# EAGLE design audio-mixer (EAGLE 6.6.0)
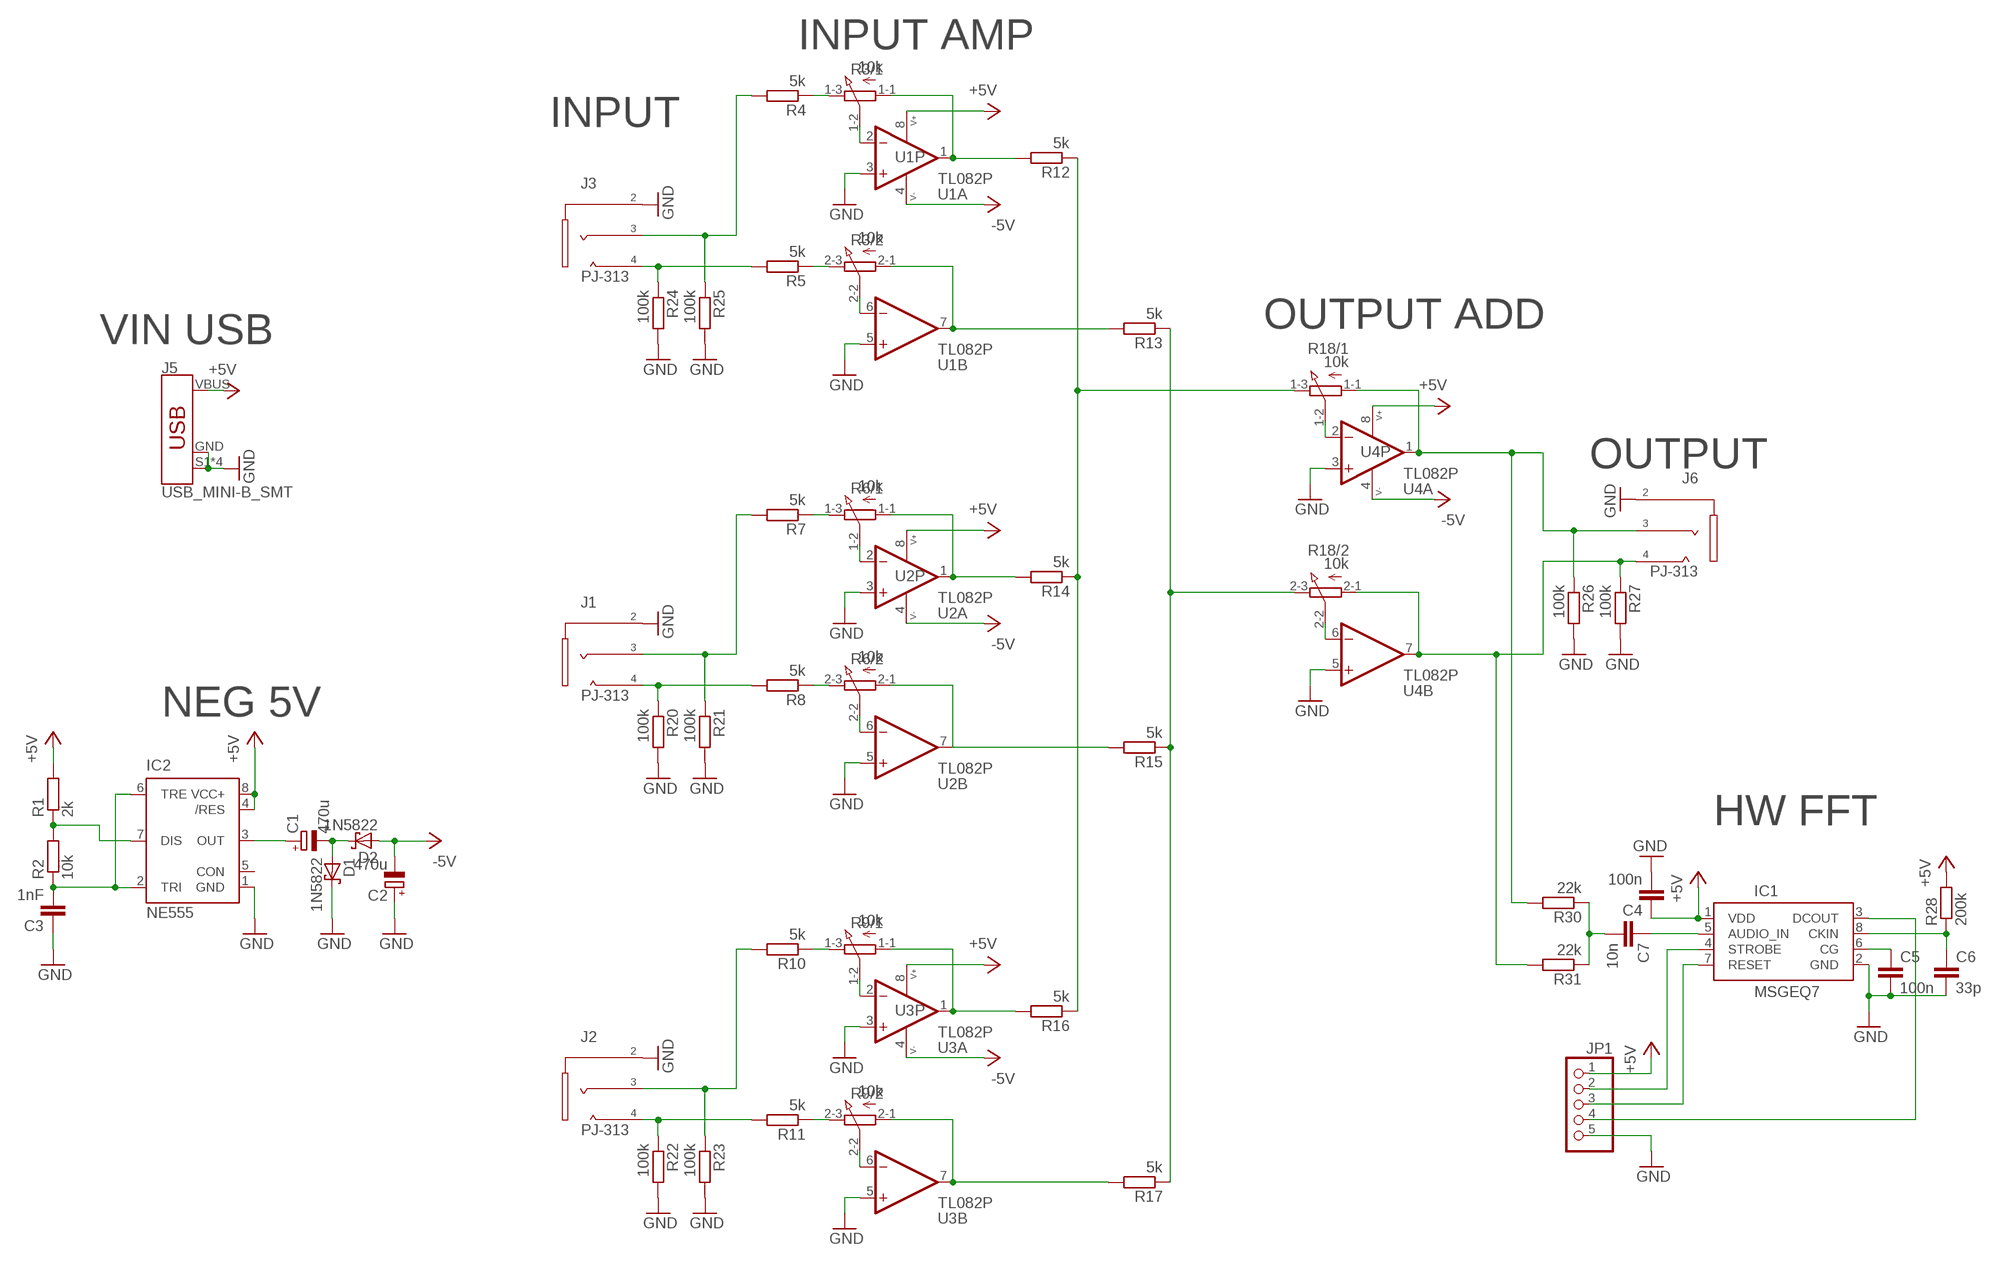
[diagram p0: schematic, sheet 1]

## Parts
C1  470u  CPOL-EUE5-8.5  [E5-8,5]
C2  470u  CPOL-EUE5-8.5  [E5-8,5]
C3  1nF  C-EU025-025X050  [C025-025X050]
C4  100n  C-EU025-025X050  [C025-025X050]
C5  100n  C-EU025-025X050  [C025-025X050]
C6  33p  C-EU025-025X050  [C025-025X050]
C7  10n  C-EU025-025X050  [C025-025X050]
D1  1N5822  1N5817-B  [DO41-7.6]
D2  1N5822  1N5817-B  [DO41-7.6]
IC1  MSGEQ7DIP  [DIL08]
IC2  NE555  [DIL-08]
J1  PJ-313  [PJ-313]
J2  PJ-313  [PJ-313]
J3  PJ-313  [PJ-313]
J5  USB_MINI-B_SMT  [USB-MINIB]
J6  PJ-313  [PJ-313]
JP1  PINHD-1X05_2.54-S  [1X05-S]
R1  2k  R-EU_0207/10  [0207/10]
R2  10k  R-EU_0207/10  [0207/10]
R3  10k  3RP/1610G  [3RP/1610G]
R4  5k  R-EU_0207/10  [0207/10]
R5  5k  R-EU_0207/10  [0207/10]
R6  10k  3RP/1610G  [3RP/1610G]
R7  5k  R-EU_0207/10  [0207/10]
R8  5k  R-EU_0207/10  [0207/10]
R9  10k  3RP/1610G  [3RP/1610G]
R10  5k  R-EU_0207/10  [0207/10]
R11  5k  R-EU_0207/10  [0207/10]
R12  5k  R-EU_0207/10  [0207/10]
R13  5k  R-EU_0207/10  [0207/10]
R14  5k  R-EU_0207/10  [0207/10]
R15  5k  R-EU_0207/10  [0207/10]
R16  5k  R-EU_0207/10  [0207/10]
R17  5k  R-EU_0207/10  [0207/10]
R18  10k  3RP/1610G  [3RP/1610G]
R20  100k  R-EU_0207/10  [0207/10]
R21  100k  R-EU_0207/10  [0207/10]
R22  100k  R-EU_0207/10  [0207/10]
R23  100k  R-EU_0207/10  [0207/10]
R24  100k  R-EU_0207/10  [0207/10]
R25  100k  R-EU_0207/10  [0207/10]
R26  100k  R-EU_0207/10  [0207/10]
R27  100k  R-EU_0207/10  [0207/10]
R28  200k  R-EU_0207/10  [0207/10]
R30  22k  R-EU_0207/10  [0207/10]
R31  22k  R-EU_0207/10  [0207/10]
U1  TL082P  [DIL08]
U2  TL082P  [DIL08]
U3  TL082P  [DIL08]
U4  TL082P  [DIL08]

## Nets
+5V [power]: C4.1 IC1.1(VDD) IC2.4(/RES) IC2.8(VCC+) J5.VBUS JP1.1 R1.2 R28.2 U1.8(P:V+) U2.8(P:V+) U3.8(P:V+) U4.8(P:V+)
-5V [power]: C2.- D2.A U1.4(P:V-) U2.4(P:V-) U3.4(P:V-) U4.4(P:V-)
GND [power]: C2.+ C3.1 C4.2 C5.2 C6.2 D1.C IC1.2(GND) IC2.1(GND) J1.2_1 J1.2_2 J2.2_1 J2.2_2 J3.2_1 J3.2_2 J5.GND J5.S1(SHIELD) J5.S2(SHIELD) J5.S3(SHIELD) J5.S4(SHIELD) J6.2_1 J6.2_2 JP1.5 R20.2 R21.2 R22.2 R23.2 R24.2 R25.2 R26.2 R27.2 U1.3(A:+IN) U1.5(B:+IN) U2.3(A:+IN) U2.5(B:+IN) U3.3(A:+IN) U3.5(B:+IN) U4.3(A:+IN) U4.5(B:+IN)
N$1: C3.2 IC2.2(TRI) IC2.6(TRE) R2.1
N$2: IC2.7(DIS) R1.1 R2.2
N$3: R3.1-1(/1:A) R12.2 U1.1(A:OUT)
N$4 [power]: C1.- D1.A D2.C
N$5 [power]: C1.+ IC2.3(OUT)
N$6: R3.1-2(/1:S) U1.2(A:-IN)
N$7: R3.2-1(/2:A) R13.2 U1.7(B:OUT)
N$8: R3.2-2(/2:S) U1.6(B:-IN)
N$9: R3.2-3(/2:E) R5.1
N$10: R3.1-3(/1:E) R4.1
N$11: J3.4_1 J3.4_2 R5.2 R24.1
N$12: J3.3 R4.2 R25.1
N$13: R6.1-1(/1:A) R14.2 U2.1(A:OUT)
N$14: R6.1-2(/1:S) U2.2(A:-IN)
N$15: R6.2-1(/2:A) R15.2 U2.7(B:OUT)
N$16: R6.2-2(/2:S) U2.6(B:-IN)
N$17: R6.2-3(/2:E) R8.1
N$18: R6.1-3(/1:E) R7.1
N$19: J1.4_1 J1.4_2 R8.2 R20.1
N$20: J1.3 R7.2 R21.1
N$21: R9.1-1(/1:A) R16.2 U3.1(A:OUT)
N$22: R9.1-2(/1:S) U3.2(A:-IN)
N$23: R9.2-1(/2:A) R17.2 U3.7(B:OUT)
N$24: R9.2-2(/2:S) U3.6(B:-IN)
N$25: R9.2-3(/2:E) R11.1
N$26: R9.1-3(/1:E) R10.1
N$27: J2.4_1 J2.4_2 R11.2 R22.1
N$28: J2.3 R10.2 R23.1
N$29: R12.1 R14.1 R16.1 R18.1-3(/1:E)
N$30: R13.1 R15.1 R17.1 R18.2-3(/2:E)
N$31: J6.3 R18.1-1(/1:A) R26.1 R30.2 U4.1(A:OUT)
N$32: J6.4_1 J6.4_2 R18.2-1(/2:A) R27.1 R31.2 U4.7(B:OUT)
N$33: R18.2-2(/2:S) U4.6(B:-IN)
N$34: R18.1-2(/1:S) U4.2(A:-IN)
N$35: C5.1 IC1.6(CG)
N$37: C6.1 IC1.8(CKIN) R28.1
N$38: C7.1 IC1.5(AUDIO_IN)
N$39: C7.2 R30.1 R31.1
N$41: IC1.4(STROBE) JP1.2
N$42: IC1.7(RESET) JP1.3
N$43: IC1.3(DCOUT) JP1.4
Unconnected: IC2.5(CON)

## Notes on the sheet
- INPUT AMP
- INPUT
- OUTPUT ADD
- VIN USB
- OUTPUT
- NEG 5V
- HW FFT

## Library data of the parts
C1 C2 = rcl:CPOL-EU: POLARIZED CAPACITOR, European symbol
C3-C7 = rcl:C-EU: CAPACITOR, European symbol
D1 D2 = diode:1N581*: 1.0A SCHOTTKY BARRIER RECTIFIER Source: http://www.diodes.com/datasheets/ds23001.pdf
IC1 = msgeq7:MSGEQ7: 7-band graphic equalizer
IC2 = st-microelectronics:NE555: General purpose bipolar Timer; MF: Arrow Electronics; MPN: NE555N; OC_FARNELL: 1467742; OC_NEWARK: 89K1486
J1-J3 J6 = headphonejack:PJ-313: 3.5mm jack description Brover Geldrop MK
J5 = SparkFun-Connectors:USB_MINI-B: USB type Mini-B Connector Breaks out 5th pin, and includes shield pins if needed. SparkFun Products: SparkFun FTDI Basic Breakout <https://www.sparkfun.com/products/9716> SparkFun XBee Explorer USB <https://www.sparkfun.com/products/11812> SparkFun Redboard <https://www.sparkfun.com/products/12757>; PROD_ID: CONN-08193; SF_ID: PRT-00587
JP1 = pinhead-2:PINHD-1X05: PIN HEADER
R1 R2 R4 R5 R7 R8 R10-R17 R20-R28 R30 R31 = rcl:R-EU_: RESISTOR, European symbol
R3 R6 R9 R18 = pot:3RP/1610G: 16mm Potentiometer two level Source: http://www.alphapotentiometers.net/html/16mm_pot_2.html
U1-U4 = op-amp:TL082: JFET OP-AMP - Dual

## Net classes
0 default: width 0.406 mm, drill 0.5 mm
1 power: width 0.61 mm, drill 0.6 mm

## Board
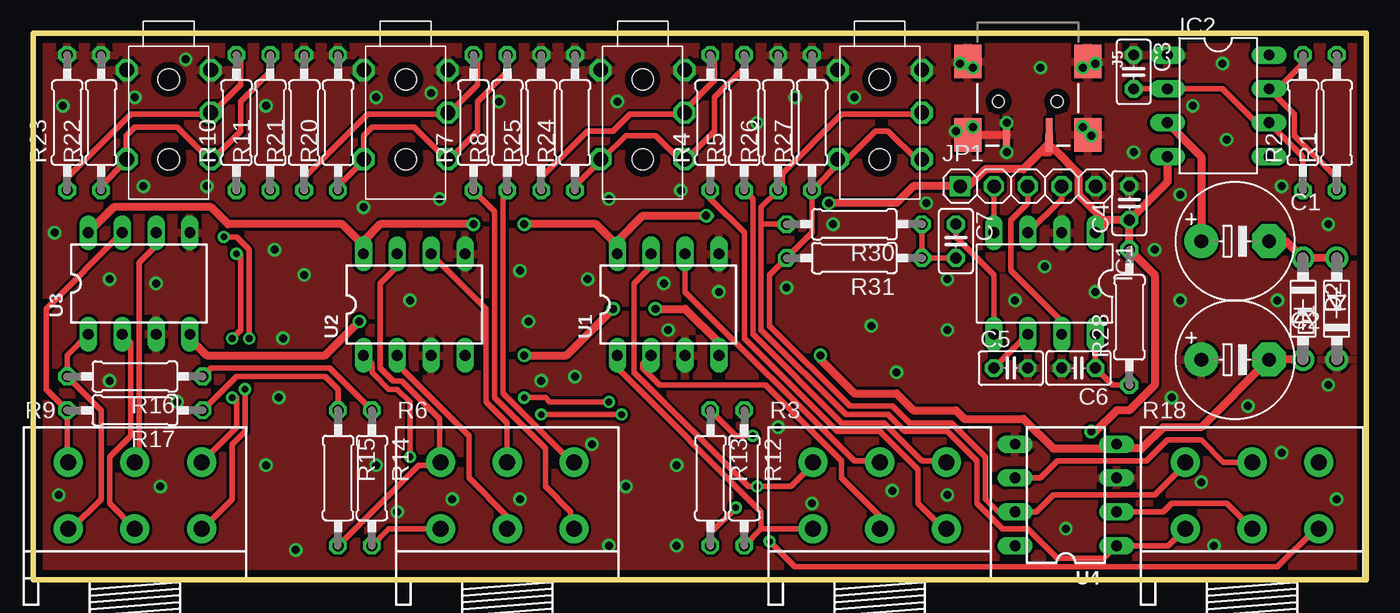
[diagram p1: board, top side]
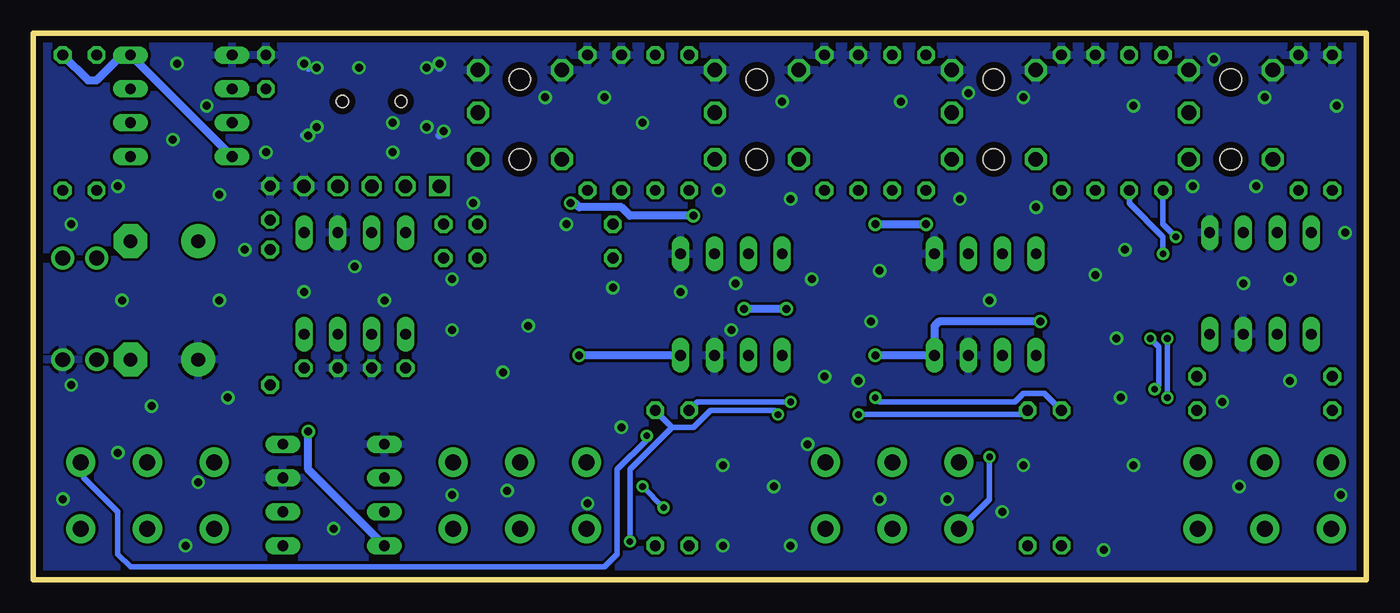
[diagram p2: board, bottom side, seen from below]

Size 100 x 41 mm. Coordinates in mm from the lower left corner, seen from the top.
Outline: 0,0 0,41 100,41 100,0 0,0
Copper layers (1*16): Top 0.035mm / dielectric 1.5mm / Bottom 0.035mm
Design rules "default *": minimum track width 10mil, minimum drill 0.5mm, track to track 8mil, track to pad 8mil, pad to pad 8mil, via to via 8mil, smd to smd 0mil, copper to edge 20mil, drill to drill 8mil, minimum pad ring 10mil, minimum via ring 8mil, stop-mask expansion 4mil, vias tented up to drill 0.6mm, thermal gap 10mil

### Footprints (pad centres in the part's own frame; a part is rotated, then mirrored left to right if it is on the bottom)
E5-8,5 = drill 1.016 pad 2.54: + -2.54,0 | drill 1.016 pad 2.54 octagon: - 2.54,0
C025-025X050 = drill 0.813 octagon: 1 -1.27,0; 2 1.27,0
DO41-7.6 = drill 1.1 pad 1.7: A 3.81,0; C -3.81,0
DIL08 = drill 0.813 long: 1 -3.81,-3.81; 2 -1.27,-3.81; 3 1.27,-3.81; 4 3.81,-3.81; 5 3.81,3.81; 6 1.27,3.81; 7 -1.27,3.81; 8 -3.81,3.81
DIL-08 = drill 0.813 long: 1 -3.81,-3.81; 2 -1.27,-3.81; 3 1.27,-3.81; 4 3.81,-3.81; 5 3.81,3.81; 6 1.27,3.81; 7 -1.27,3.81; 8 -3.81,3.81
PJ-313 = drill 1.1 octagon: 2_1 -3.95,3.15; 2_2 -3.95,-3.15; 3 -0.75,3.15; 4_1 2.75,3.15; 4_2 2.75,-3.15 | hole 1.6: -3.25,0; 2.75,0
USB-MINIB = smd 2.5 x 0.5: GND 2.5,-1.6; VBUS 2.5,1.6 | smd 2.5 x 2: S1 -3,4.5; S2 2.5,4.5; S3 -3,-4.5; S4 2.5,-4.5 | hole 0.9: 0,2.2; 0,-2.2
1X05-S = drill 1.016 square: 1 -5.08,0 | drill 1.016 octagon: 2 -2.54,0; 3 0,0; 4 2.54,0; 5 5.08,0
0207/10 = drill 0.813 octagon: 1 -5.08,0; 2 5.08,0
3RP/1610G = drill 1.2 pad 2.184: 1-1 -5,0; 1-2 0,0; 1-3 5,0; 2-1 -5,5; 2-2 0,5; 2-3 5,5

### Placement (x,y rotation side)
C1  90.17,25.4 0 top
C2  90.17,16.51 0 top
C3  82.55,38.1 270 top
C4  82.23,28.26 90 top
C5  73.34,15.88 0 top
C6  78.42,15.88 180 top
C7  69.22,25.4 270 top
D1  97.79,20.32 90 top
D2  95.25,20.32 270 top
IC1  75.88,22.23 180 top
IC2  88.9,35.56 270 top
J1  27.94,34.29 270 top
J2  10.16,34.29 270 top
J3  45.72,34.29 270 top
J5  74.61,35.88 270 top
J6  63.5,34.29 270 top
JP1  74.61,29.53 0 top
R1  97.79,34.29 90 top
R2  95.25,34.29 90 top
R3  63.5,3.81 0 top
R4  50.8,34.29 90 top
R5  53.34,34.29 90 top
R6  35.56,3.81 0 top
R7  33.02,34.29 90 top
R8  35.56,34.29 90 top
R9  7.62,3.81 0 top
R10  15.24,34.29 90 top
R11  17.78,34.29 90 top
R12  53.34,7.62 270 top
R13  50.8,7.62 270 top
R14  25.4,7.62 270 top
R15  22.86,7.62 270 top
R16  7.62,15.24 180 top
R17  7.62,12.7 180 top
R18  91.44,3.81 0 top
R20  22.86,34.29 90 top
R21  20.32,34.29 90 top
R22  5.08,34.29 90 top
R23  2.54,34.29 90 top
R24  40.64,34.29 90 top
R25  38.1,34.29 90 top
R26  55.88,34.29 90 top
R27  58.42,34.29 90 top
R28  82.23,19.68 90 top
R30  61.59,26.67 180 top
R31  61.59,24.13 180 top
U1  47.62,20.64 0 top
U2  28.57,20.64 0 top
U3  7.94,22.23 0 top
U4  77.47,6.35 90 top

### Tracks (layer width: path | path; a pad name or v marks a point on that pad's centre or on a via)
+5V  (via drill 0.6)
  Top 0.61: v36.83,26.67 42.23,26.67 43.81,25.08 U1.8 43.81,25.4 45.72,27.3 v50.48,27.3 50.8,27.3 | v33.02,26.67 26.04,26.67 24.77,25.4 U2.8 24.77,25.08 23.18,26.67 14.61,26.67 13.34,27.94 6.03,27.94 U3.8 | 75.72,32.23 76.2,32.7 76.2,33.34 J5.VBUS | 75.72,32.23 74.3,30.8 71.44,30.8 70.17,29.53 JP1.1 66.04,29.53 64.77,28.26 v59.69,28.26 | C4.1 80.64,26.99 IC1.1 80.33,26.99 78.42,28.89 78.42,30.48 76.52,32.38 76.2,32.07 75.88,32.07 75.72,32.23 | C4.1 R28.2 84.14,22.86 84.14,14.61 82.23,12.7 81.28,12.7 79.69,11.11 v79.38,11.11 | C4.1 85.09,29.84 IC2.4
  Bottom 0.61: v36.83,26.67 v33.02,26.67 | IC2.4 IC2.8 92.71,39.05 93.66,39.05 95.25,37.47 95.89,37.47 R1.2 | v59.69,28.26 59.37,28.26 59.05,27.94 55.88,27.94 55.24,27.3 v50.48,27.3 | v79.38,11.11 79.38,8.26 U4.8
-5V  (via drill 0.6)
  Top 0.61: D2.A C2.- 87.63,11.43 84.77,11.43 83.19,9.84 81.6,9.84 U4.4 81.28,9.84 76.52,9.84 74.3,12.06 69.85,12.06 69.22,12.7 66.04,12.7 64.77,13.97 61.59,13.97 59.05,16.51 v59.05,16.83 | U3.4 11.75,18.1 13.02,16.83 21.91,16.83 v24.45,19.37 | v36.83,16.83 40.01,16.83 v43.5,20.32 | v46.67,20.32 48.9,20.32 51.44,17.78 U1.4
  Bottom 0.61: v24.45,19.37 32.07,19.37 32.38,19.05 U2.4 v36.83,16.83 | v43.5,20.32 v46.67,20.32 | U1.4 v59.05,16.83
GND  (via drill 0.6)
  Top 0.61: J5.S1 79.55,38.88 v79.69,38.73 | J5.S3 69.67,38.88 v69.53,38.73 | J5.GND J5.S4 70.11,33.39 v69.22,33.66 | J5.S2 79.33,33.38 v79.38,33.34
  Bottom 0.61: v79.69,38.73 79.38,38.42 | v69.53,38.73 69.53,38.42 | v69.22,33.66 69.53,33.34 | v79.38,33.34 79.69,33.34
  other vias: 17.46,8.57 18.41,13.65 18.73,18.1 20.32,22.86 18.1,24.77 9.21,22.23 5.71,22.54 1.59,26.04 8.26,29.53 13.02,29.53 24.77,27.94 30.48,28.57 43.18,28.57 41.59,22.54 36.51,23.18 40.64,15.24 38.1,14.92 41.91,10.16 44.45,6.99 48.26,8.57 43.18,2.54 48.26,2.54 19.68,2.22 58.42,5.71 55.88,11.43 47.62,18.73 47.31,22.23 51.44,21.59 48.58,29.21 56.52,21.91 60.01,26.67 66.99,28.26 68.58,22.54 73.66,20.95 75.88,23.5 79.69,21.59 70.48,33.97 70.48,38.42 78.74,38.42 78.74,33.97 73.03,34.29 73.03,32.07 84.14,24.77 86.04,28.89 82.55,32.07 89.53,33.02 87,35.56 89.22,38.73 93.66,29.53 97.16,26.67 93.34,20.95 86.04,20.95 85.41,13.65 91.12,13.02 97.16,14.61 93.66,9.53 97.79,6.03 87.63,7.3 77.47,3.81 88.58,2.54 68.58,6.35 64.45,6.67 64.77,15.56 68.58,18.73 62.87,19.05 54.29,34.29 57.15,36.2 61.59,36.2 75.56,38.42 43.81,35.88 25.72,36.2 34.92,35.88 29.84,36.51 17.46,35.56 7.62,36.2 11.43,39.05 2.22,35.56 9.53,6.99 1.91,6.35 5.71,14.92 10.79,13.34 31.43,6.03 36.51,6.03 27.3,5.08 25.72,8.57 28.26,20.95 37.15,19.37
  pour Bottom: -3.49,44.13 103.82,44.13 103.82,-1.91 -3.49,-1.91
  pour Top: 0.32,40.64 100.01,40.96 99.69,0.32 0,0
N$1
  Top 0.406: C3.2 IC2.2 89.22,36.83 91.76,34.29 IC2.6 95.25,31.75 R2.1
N$2
  Top 0.406: R1.1 97.79,30.16 94.61,33.34 94.61,34.92 93.03,36.51 | 93.03,36.51 95.25,38.73 R2.2 | 93.03,36.51 IC2.7
N$3
  Top 0.406: 54.61,3.81 R3.1-1 | R12.2 54.61,3.81 | 54.61,3.81 54.61,5.08 43.81,15.88 U1.1
N$4
  Top 0.61: C1.- 93.98,25.4 D2.C D1.A
N$5
  Top 0.61: C1.+ 87.63,31.75 IC2.3
N$6
  Top 0.406: R3.1-2 63.5,4.76 60.64,7.62 60.64,8.89 54.93,14.61 46.99,14.61 45.72,15.88 45.72,16.19 U1.2
N$7  (via drill 0.5)
  Top 0.406: R13.2 50.8,3.49 v52.7,5.4 | R3.2-1 58.42,8.57 56.83,6.99 v54.29,6.99 53.66,6.99 45.09,15.56 45.09,22.23 46.35,23.5 U1.7
  Bottom 0.406: v54.29,6.99 v52.7,5.4
N$8
  Top 0.406: U1.6 48.9,21.59 61.59,8.89 63.5,8.89 R3.2-2
N$9
  Top 0.406: R5.1 53.98,28.57 53.98,18.41 60.64,11.75 63.82,11.75 66.67,8.89 68.26,8.89 R3.2-3
N$10
  Top 0.406: R3.1-3 68.26,3.81 66.36,5.71 66.36,8.26 63.5,11.11 60.33,11.11 53.34,18.1 53.34,26.04 50.8,28.57 R4.1
N$11
  Top 0.406: R24.1 40.64,29.53 42.55,31.43 J3.4_2 42.86,31.75 44.45,33.34 46.67,33.34 48.58,31.43 J3.4_1 48.9,31.43 51.12,33.66 51.12,36.2 53.34,38.42 R5.2
N$12
  Top 0.406: R4.2 51.12,39.05 51.12,37.47 48.9,35.24 J3.3 48.58,34.92 44.77,34.92 43.5,33.66 41.59,33.66 38.1,30.16 R25.1
N$13  (via drill 0.5)
  Top 0.406: R6.1-1 26.67,3.81 R14.2 | v28.26,9.21 28.26,13.34 27.3,14.29 26.67,14.29 25.4,15.56 25.4,16.19 U2.1
  Bottom 0.406: v28.26,9.21 28.26,6.03 30.48,3.81 R6.1-1
N$14
  Top 0.406: R6.1-2 35.56,4.76 32.7,7.62 32.7,10.79 27.3,16.19 U2.2
N$15
  Top 0.406: R15.2 28.89,8.57 30.48,8.57 R6.2-1 30.48,8.89 30.48,12.06 27.62,14.92 26.99,14.92 26.04,15.88 26.04,22.23 27.3,23.5 U2.7
N$16
  Top 0.406: R6.2-2 35.56,11.75 33.97,13.34 33.97,20.32 U2.6
N$17
  Top 0.406: R8.1 35.24,28.89 35.24,13.97 40.32,8.89 R6.2-3
N$18
  Top 0.406: R7.1 34.61,27.62 34.61,13.65 38.42,9.84 38.42,6.99 40.32,5.08 40.32,3.81 R6.1-3
N$19
  Top 0.406: R8.2 35.56,38.1 33.34,35.88 33.34,33.66 31.11,31.43 J1.4_1 30.8,31.75 28.57,33.97 25.4,33.97 24.77,33.34 24.77,31.75 J1.4_2 24.77,31.43 22.86,29.53 R20.1
N$20
  Top 0.406: R7.2 33.34,39.05 33.34,37.15 31.11,34.92 J1.3 30.8,34.92 25.08,34.92 20.32,30.16 R21.1
N$21
  Top 0.406: R9.1-1 2.86,3.81 5.08,6.03 5.08,12.7 R16.2 2.54,16.83 U3.1
N$22
  Top 0.406: U3.2 7.3,17.78 7.3,10.79 5.71,9.21 5.71,5.71 R9.1-2
N$23
  Top 0.406: R9.2-1 2.54,8.89 R17.2 0.95,14.29 0.95,20.32 U3.7
N$24
  Top 0.406: U3.6 9.21,25.08 7.94,23.81 7.94,9.21 7.62,8.89 R9.2-2
N$25  (via drill 0.5)
  Top 0.406: R9.2-3 15.24,11.43 15.24,13.65 v14.92,13.65 | v14.92,18.1 15.56,18.73 15.56,24.45 v15.24,24.45
  Bottom 0.406: v14.92,13.65 v14.92,18.1 | v15.24,24.45 15.24,25.72 17.78,28.26 R11.1
N$26  (via drill 0.5)
  Top 0.406: v15.88,14.29 15.88,11.11 14.92,10.16 14.92,6.03 12.7,3.81 R9.1-3 | v16.19,18.1 16.19,24.77 15.24,25.72 v14.29,25.72
  Bottom 0.406: v16.19,18.1 15.56,17.46 15.56,14.61 v15.88,14.29 | v14.29,25.72 15.24,26.67 R10.1
N$27
  Top 0.406: R11.2 17.78,38.1 15.56,35.88 15.56,33.66 13.34,31.43 J2.4_1 13.02,31.75 10.79,33.97 7.62,33.97 6.99,33.34 6.99,31.75 J2.4_2 6.99,31.43 5.08,29.53 R22.1
N$28
  Top 0.406: R10.2 15.56,39.05 15.56,37.15 13.34,34.92 J2.3 13.02,34.92 7.3,34.92 2.54,30.16 R23.1
N$29  (via drill 0.5)
  Top 0.406: R14.1 22.23,15.88 13.34,15.88 R16.1 | v38.1,12.38 v44.13,12.38 | R18.1-3 96.2,3.81 93.34,0.95 57.15,0.95 v55.24,2.86
  Bottom 0.406: v38.1,12.38 25.72,12.38 R14.1 | v44.13,12.38 44.45,12.7 49.21,12.7 50.48,11.43 52.07,11.43 | R12.1 52.07,11.43 | v55.24,2.86 55.24,8.26 52.07,11.43
N$30  (via drill 0.5)
  Top 0.406: R15.1 22.86,14.29 21.91,15.24 15.24,15.24 R17.1 | v36.83,13.65 38.42,13.65 38.73,13.34 v43.18,13.34 | v53.98,10.79 52.7,10.79 R13.1
  Bottom 0.406: v36.83,13.65 36.51,13.34 26.35,13.34 25.72,13.97 24.13,13.97 R15.1 | v43.18,13.34 50.16,13.34 R13.1 | v53.98,10.79 53.98,10.48 56.2,8.26 56.2,1.91 57.15,0.95 92.71,0.95 93.66,1.91 93.66,5.08 96.2,7.62 96.2,8.57 R18.2-3
N$31
  Top 0.406: J6.3 66.36,34.92 60.64,34.92 56.2,30.48 56.2,29.53 R26.1 54.61,27.94 54.61,26.67 | R18.1-1 85.17,2.54 U4.1 80.33,1.59 76.83,1.59 74.61,3.81 72.71,3.81 70.8,5.71 70.8,8.89 68.58,11.11 65.41,11.11 64.14,12.38 60.96,12.38 54.61,18.73 54.61,26.67 | 54.61,26.67 R30.2
N$32
  Top 0.406: J6.4_1 66.36,31.43 64.14,33.66 63.18,33.66 60.96,31.43 J6.4_2 60.64,31.43 R27.1 58.42,26.04 R31.2 55.24,22.86 55.24,19.05 61.28,13.02 64.45,13.02 65.72,11.75 68.9,11.75 71.44,9.21 71.44,6.03 72.39,5.08 U4.7 75.25,5.08 76.52,6.35 84.14,6.35 86.44,8.65 R18.2-1
N$33
  Top 0.406: R18.2-2 89.3,8.81 87.63,10.48 85.09,10.48 83.5,8.89 76.83,8.89 75.56,7.62 U4.6
N$34
  Top 0.406: U4.2 84.77,5.08 85.41,5.71 89.53,5.71 R18.1-2
N$35
  Top 0.406: IC1.6 C5.1
N$37
  Top 0.406: R28.1 80.96,14.61 C6.1 IC1.8
N$38
  Top 0.406: IC1.5 72.07,22.86 69.22,25.72 C7.1
N$39
  Top 0.406: R30.1 R31.1 C7.2
N$41
  Top 0.406: JP1.2 IC1.4
N$42
  Top 0.406: IC1.7 77.15,19.37 73.34,23.18 73.34,26.99 74.61,28.26 JP1.3
N$43
  Top 0.406: IC1.3 77.15,28.57 JP1.4